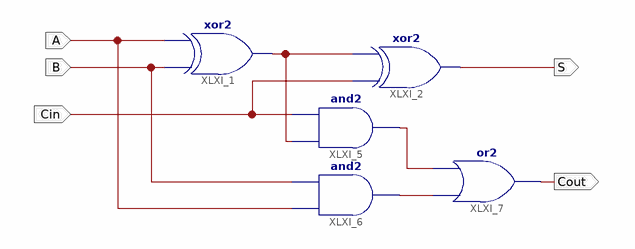
[diagram p0: schematic sheet 1]
// Xilinx ISE schematic FA.sch (spartan3) as structural Verilog: 5 symbols, 5 ports
module FA (
  input  A,
  input  B,
  input  Cin,
  output S,
  output Cout
);

  wire XLXN_7, XLXN_10, XLXN_11;

  xor XLXI_1 (XLXN_7, B, A);
  xor XLXI_2 (S, Cin, XLXN_7);
  and XLXI_5 (XLXN_10, XLXN_7, Cin);
  and XLXI_6 (XLXN_11, A, B);
  or XLXI_7 (Cout, XLXN_11, XLXN_10);
endmodule
